# Altium schematic sheet Final_Year_Project.SchDoc
size A2; SheetNumber: 1; SheetTotal: 1
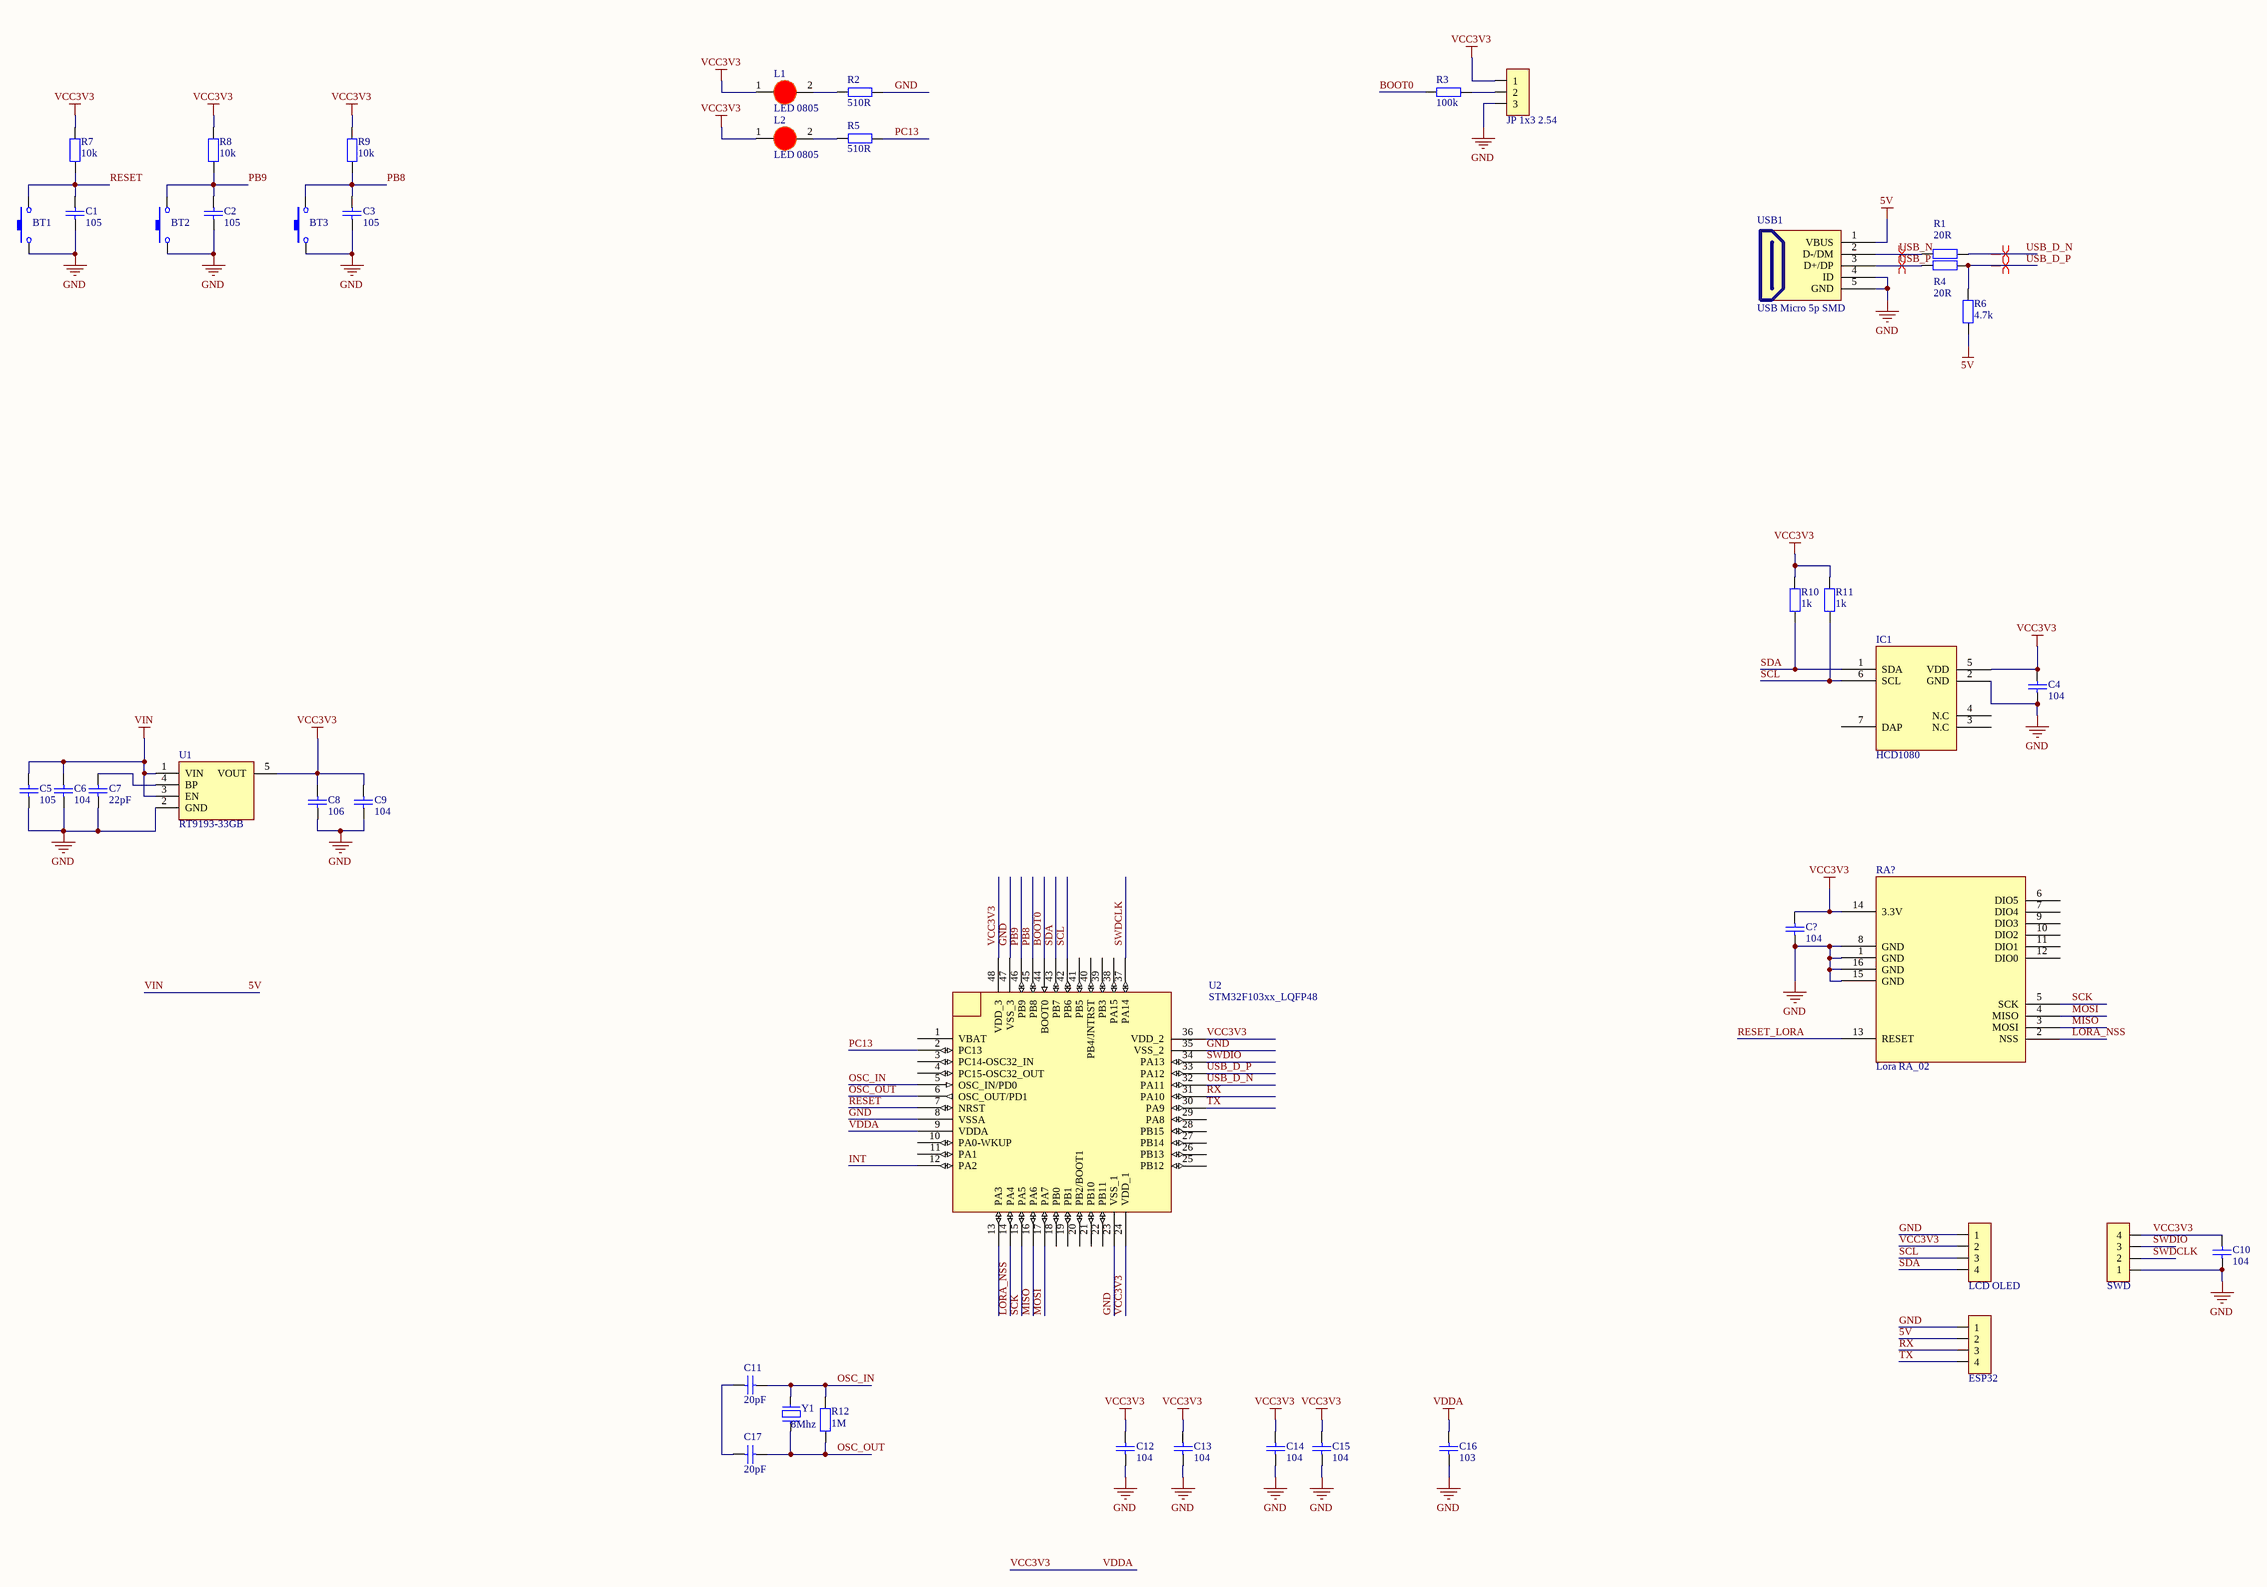
[diagram p0: Final_Year_Project.SchDoc]

## Parts
BT1  Nut Nhan 2 Chan SMD 3x6x2.5  [Nut Nhan 2 Chan SMD 3x6x2.5]  (value not drawn)
BT2  Nut Nhan 2 Chan SMD 3x6x2.5  [Nut Nhan 2 Chan SMD 3x6x2.5]  (value not drawn)
BT3  Nut Nhan 2 Chan SMD 3x6x2.5  [Nut Nhan 2 Chan SMD 3x6x2.5]  (value not drawn)
C1  105  [tu 0603]
C2  105  [tu 0603]
C3  105  [tu 0603]
C4  104  [tu 0603]
C5  105  [tu 0603]
C6  104  [tu 0603]
C7  22pF  [tu 0603]
C8  106  [tu 0603]
C9  104  [tu 0603]
C10  104  [tu 0603]
C11  20pF  [tu 0805]
C12  104  [tu 0603]
C13  104  [tu 0603]
C14  104  [tu 0603]
C15  104  [tu 0603]
C16  103  [tu 0603]
C17  20pF  [tu 0805]
C?  104  [tu 0603]
IC1  HCD1080  [HDC1080]
JP1  JP 1x3 2.54  [JP 1x3 DT]
JP3  LCD OLED  [JP 1x4 DT]
JP4  SWD  [JP 1x4 DT]
JP5  ESP32  [JP 1x4 DT]
L1  LED 0805  [LED-0805-Red]
L2  LED 0805  [LED-0805-Red]
R1  20R  [tro smd 0603]
R2  510R  [tro smd 0603]
R3  100k  [tro smd 0603]
R4  20R  [tro smd 0603]
R5  510R  [tro smd 0603]
R6  4.7k  [tro smd 0603]
R7  10k  [tro smd 0603]
R8  10k  [tro smd 0603]
R9  10k  [tro smd 0603]
R10  1k  [tro smd 0603]
R11  1k  [tro smd 0603]
R12  1M  [tro smd 0603]
RA?  Lora RA_02
U1  RT9193-33GB  [SOT23-5]
U2  STM32F103xx_LQFP48  [STM32_LQPF48]
USB1  USB Micro 5p SMD  [USB Micro 5p SMD]
Y1  8Mhz  [Thach Anh 2 chan SMD5032]

## Nets
5V: C5.1 C6.1 JP5.2 R6.1 U1.1(VIN) U1.3(EN) USB1.1(VBUS)  [also labelled VIN]
GND: BT1.1 BT2.1 BT3.1 C1.2 C2.2 C3.2 C4.2 C5.2 C6.2 C7.2 C8.2 C9.2 C10.2 C12.2 C13.2 C14.2 C15.2 C16.2 C?.2 IC1.2(GND) JP1.3 JP3.1 JP4.1 JP5.1 R2.2 RA?.1(GND) RA?.8(GND) RA?.15(GND) RA?.16(GND) U1.2(GND) U2.8(VSSA) U2.23(VSS_1) U2.35(VSS_2) U2.47(VSS_3) USB1.4(ID) USB1.5(GND)
VCC3V3: C4.1 C8.1 C9.1 C10.1 C12.1 C13.1 C14.1 C15.1 C16.1 C?.1 IC1.5(VDD) JP1.1 JP3.2 JP4.4 L1.1(A) L2.1(A) R7.2 R8.2 R9.2 R10.2 R11.2 RA?.14(3.3V) U1.5(VOUT) U2.9(VDDA) U2.24(VDD_1) U2.36(VDD_2) U2.48(VDD_3)  [also labelled VDDA]
BOOT0: R3.1 U2.44(BOOT0)
INT: U2.12(PA2)
LORA_NSS: RA?.2(NSS) U2.14(PA4)
MISO: RA?.3(MOSI) U2.16(PA6)
MOSI: RA?.4(MISO) U2.17(PA7)
OSC_IN: C11.1 R12.2 U2.5(OSC_IN/PD0) Y1.2
OSC_OUT: C17.1 R12.1 U2.6(OSC_OUT/PD1) Y1.1
PB8: BT3.2 C3.1 R9.1 U2.45(PB8)
PB9: BT2.2 C2.1 R8.1 U2.46(PB9)
PC13: R5.2 U2.2(PC13)
RESET: BT1.2 C1.1 R7.1 U2.7(NRST)
RESET_LORA: RA?.13(RESET)
RX: JP5.3 U2.31(PA10)
SCK: RA?.5(SCK) U2.15(PA5)
SCL: IC1.6(SCL) JP3.3 R11.1 U2.42(PB6)
SDA: IC1.1(SDA) JP3.4 R10.1 U2.43(PB7)
SWDCLK: JP4.2 U2.37(PA14)
SWDIO: JP4.3 U2.34(PA13)
TX: JP5.4 U2.30(PA9)
USB_D_N: R1.2 U2.32(PA11)
USB_D_P: R4.2 R6.2 U2.33(PA12)
USB_N: R1.1 USB1.2(D-/DM)
USB_P: R4.1 USB1.3(D+/DP)
NetC7_1: C7.1 U1.4(BP)
NetC11_2: C11.2 C17.2
NetJP1_2: JP1.2 R3.2
NetL1_2: L1.2(K) R2.1
NetL2_2: L2.2(K) R5.1

Not connected (* = marked no-connect by the designer): IC1 3(N.C) 4(N.C) 7(DAP); RA? 6(DIO5) 7(DIO4) 9(DIO3) 10(DIO2) 11(DIO1) 12(DIO0); U2 1(VBAT) 3(PC14-OSC32_IN) 4(PC15-OSC32_OUT) 10(PA0-WKUP) 11(PA1) 13(PA3) 18(PB0) 19(PB1) 20(PB2/BOOT1) 21(PB10) 22(PB11) 25(PB12) 26(PB13) 27(PB14) 28(PB15) 29(PA8) 38(PA15) 39(PB3) 40(PB4/JNTRST) 41(PB5)

## Layout directives
differential pair: USB_D_N, USB_D_P, USB_N, USB_P

## Library data of the parts
BT1-BT3 = Nut Nhan 2 Chan SMD 3x6x2.5: Ma_Hang: MH001036; Ten: Nút Nhấn 2 Chân 3x6x2.5MM SMD
C1-C3 = Tu 0603 105 50V 10%: Dán; Don_Vi: Con; So_Chan: 2; Ten_Linh_Kien: Tụ 0603 105-1uF 50V 10%; Ma_Hang: MH004569; Chung_Loai: Dán; Kieu_Chan: *
C4 C6 C9 C10 C12-C15 C? = Tu 0603 104 50V 10%: Dán; Don_Vi: Con; So_Chan: 2; Ten_Linh_Kien: Tụ 0603 104-100nF 10% 50V; Ma_Hang: MH004568; Chung_Loai: Dán; Kieu_Chan: *
C5 = Tu 0603 105 16V 20%: Dán; Don_Vi: Con; So_Chan: 2; Ten_Linh_Kien: Tụ 0603 105-1uF 20% 16V; Ma_Hang: MH004574; Chung_Loai: Dán; Kieu_Chan: *
C7 = Tu 0603 22pF 50V 10%: Dán; Don_Vi: Con; So_Chan: 2; Ten_Linh_Kien: Tụ 0603 22pF 50V 10%; Ma_Hang: MH004570; Chung_Loai: Dán; Kieu_Chan: *
C8 = Tu 0603 106 16V 20%: Dán; Don_Vi: Con; So_Chan: 2; Ten_Linh_Kien: Tụ 0603-10uF 20% 16V; Ma_Hang: MH004848; Chung_Loai: Dán; Kieu_Chan: *
C11 C17 = Tu 0805 20pF 50V 10%: Dán; Don_Vi: Con; Ten_Linh_Kien: Tụ 0805 20P 10% 50V; So_Chan: 2; Ma_Hang: MH004558; Chung_Loai: Dán; Kieu_Chan: *
C16 = Tu 0603 103 50V 10%: Dán; Don_Vi: Con; So_Chan: 2; Ten_Linh_Kien: Tụ 0603 103-10nF 10% 50V; Ma_Hang: MH004567; Chung_Loai: Dán; Kieu_Chan: *
JP1 = JP 1x3 2.54 Duc Thang: Cắm; Ten_Linh_Kien: Jump Đơn Đực 2.54MM 1x40P Thẳng 11MM; Don_Vi: Con; Ma_Hang: MH000903; Ghi_Chu: *; Kieu_Chan: *; Chung_Loai: Cắm
JP3-JP5 = JP 1x4 2.54 Duc Thang: Cắm; Ten_Linh_Kien: Jump Đơn Đực 2.54MM 1x40P Thẳng 11MM; Don_Vi: Con; Ma_Hang: MH000903; Ghi_Chu: *; Kieu_Chan: *; Chung_Loai: Cắm
L1 L2 = LED 0805 Do: Dán; Don_Vi: Con; Ma_Hang: MH000897; Ten_Linh_Kien: LED 0805 Màu Đỏ (Red); Ghi_Chu: *; Kieu_Chan: *; Chung_Loai: Dán
R1 R4 = Tro 0603 5% 22R: Dán; Don_Vi: Con; So_Chan: 2; Ten_Linh_Kien: Trở 0603 5% 22R; Ma_Hang: MH006331; Chung_Loai: Dán; Kieu_Chan: *
R2 R5 = Tro 0603 5% 510R: Dán; Don_Vi: Con; So_Chan: 2; Ten_Linh_Kien: Trở 0603 5% 510R; Ma_Hang: MH007667; Chung_Loai: Dán; Kieu_Chan: *
R3 = Tro 0603 5% 100k: Dán; So_Chan: 2; Ten_Linh_Kien: Trở 0603 5% 100k; Ma_Hang: MH006314; Don_Vi: Con; Chung_Loai: Dán; Kieu_Chan: *
R6 = Tro 0603 5% 4.7k: Dán; Don_Vi: Con; So_Chan: 2; Ten_Linh_Kien: Trở 0603 5% 4.7k; Ma_Hang: MH006327; Chung_Loai: Dán; Kieu_Chan: *
R7-R9 = Tro 0603 1% 10k: Dán; Don_Vi: Con; So_Chan: 2; Ten_Linh_Kien: Trở 0603 1% 10k; Ma_Hang: MH006333; Chung_Loai: Dán; Kieu_Chan: *
R10 R11 = Tro 0603 1% 1k: Dán; So_Chan: 2; Don_Vi: Con; Ten_Linh_Kien: Trở 0603 1% 1k; Ma_Hang: MH006334; Chung_Loai: Dán; Kieu_Chan: *
R12 = Tro 0603 5% 1M: Dán; Don_Vi: Con; So_Chan: 2; Ten_Linh_Kien: Trở 0603 5% 1M; Ma_Hang: MH006909; Chung_Loai: Dán; Kieu_Chan: *
U1 = REG_5.5V-3.3V-0.3A-1W-SOT-23-5: Linear Voltage Regulator IC 1 Output 300mA SOT-23-5; Manufacturer: Richtek USA Inc.; Alternate Part Number-1: NA; Manufacturer Part Number: RT9193-33GB; Supplier-1: LCSC; Supplier Part Number-1: C15651; Case/Package: SOT-23-5
USB1 = USB Micro 5p SMD: USB Type B; Ten: MicroUSB MK5P SMD; Ma_Hang: MH001020
Y1 = Thach Anh 2 chan SMD 5032: Crystal For all Crystal 2pin.; Value: 4Mhz
U2 = STM32F103xx_LQFP48: Published: 30-May-2008; DatasheetVersion: rev6, Mar-2008; PackageVersion: Mar-2008; PackageReference: LQFP48; Publisher: Altium Limited; PackageDescription: 48-Pin Low-Profile Quad Flat Pack, 7 x 7 mm Body, 0.5 mm Pitch (LQFP48); ComponentLink1Description: Manufacturer Link; ComponentLink1URL: www.st.com/stm32; ComponentLink2Description: Datasheet; ComponentLink2URL: http://www.st.com/stonline/products/literature/ds/13587.pdf